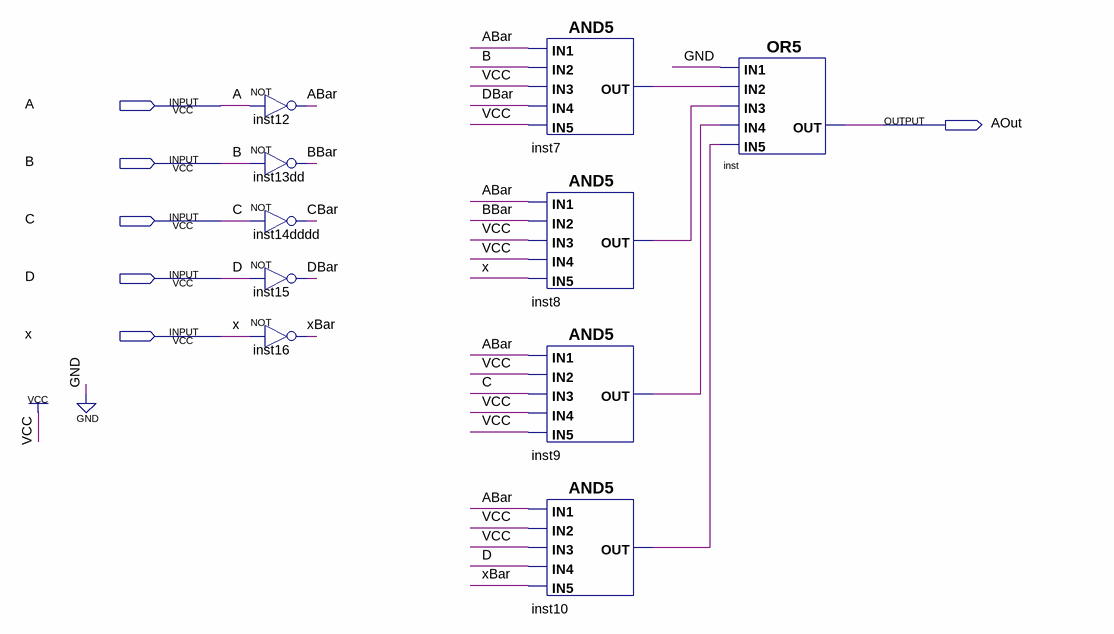
[diagram p0: schematic sheet]
// Quartus schematic AOut.bdf as structural Verilog: 10 symbols, 6 pins
module AOut (
  input  A,
  input  B,
  input  C,
  input  D,
  input  x,
  output AOut
);

  wire ABar, BBar, CBar, DBar, inst7_out, inst8_out, inst9_out, inst10_out, xBar;

  not inst12 (ABar, A);
  not inst13dd (BBar, B);
  not inst14dddd (CBar, C);
  not inst15 (DBar, D);
  not inst16 (xBar, x);
  and inst7 (inst7_out, ABar, B, 1'b1, DBar, 1'b1);
  and inst8 (inst8_out, ABar, BBar, 1'b1, 1'b1, x);
  and inst9 (inst9_out, ABar, 1'b1, C, 1'b1, 1'b1);
  and inst10 (inst10_out, ABar, 1'b1, 1'b1, D, xBar);
  or inst (AOut, 1'b0, inst7_out, inst8_out, inst9_out, inst10_out);
endmodule
